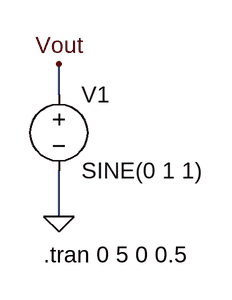
[diagram p0: schematic sine_wave.asc]
sine_wave.asc, the LTspice schematic file:
Version 4
SHEET 1 880 680
WIRE 128 64 128 32
WIRE 128 192 128 144
FLAG 128 192 0
FLAG 128 32 Vout
SYMBOL voltage 128 48 R0
WINDOW 123 0 0 Left 0
WINDOW 39 0 0 Left 0
SYMATTR InstName V1
SYMATTR Value SINE(0 1 1)
TEXT 112 232 Left 2 !.tran 0 5 0 0.5

The netlist it stands for:
* sine_wave.asc
V1 Vout 0 SINE(0 1 1)
.tran 0 5 0 0.5
.backanno
.end